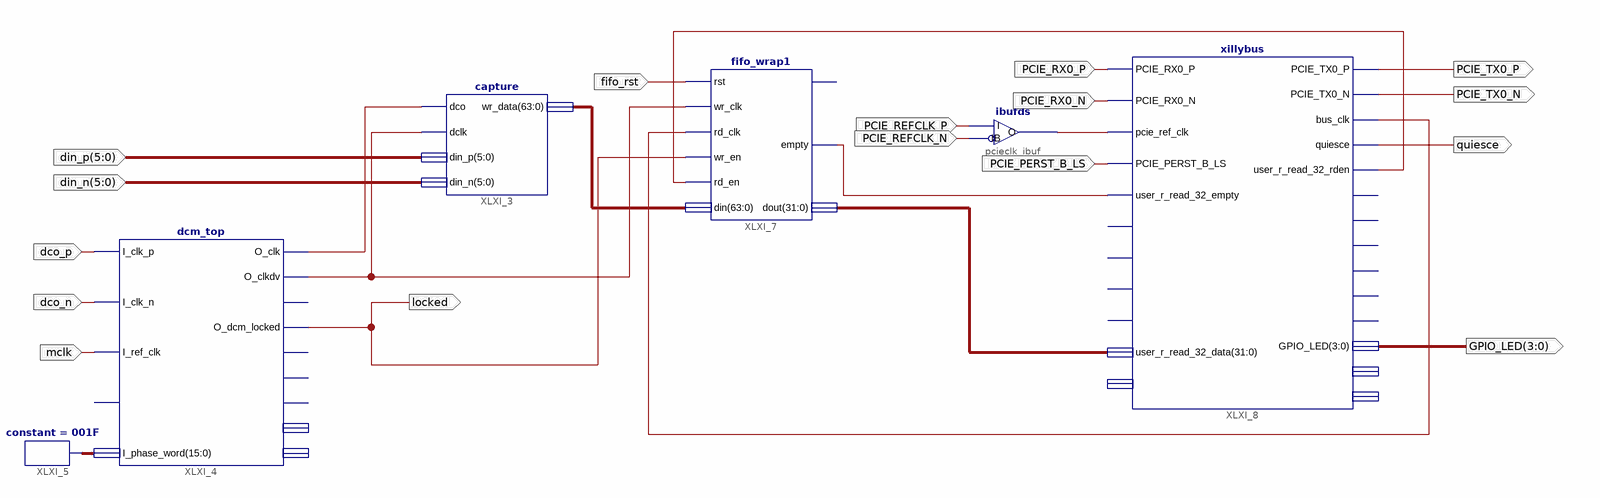
[diagram p0: schematic sheet 1]
// Xilinx ISE schematic top.sch (virtex5) as structural Verilog: 6 symbols, 16 ports
module top (
  input  dco_p,
  input  dco_n,
  input  mclk,
  input  [5:0] din_p,
  input  [5:0] din_n,
  input  fifo_rst,
  input  PCIE_RX0_P,
  input  PCIE_RX0_N,
  input  PCIE_REFCLK_P,
  input  PCIE_REFCLK_N,
  input  PCIE_PERST_B_LS,
  output locked,
  output PCIE_TX0_P,
  output PCIE_TX0_N,
  output quiesce,
  output [3:0] GPIO_LED
);

  wire pcie_ref_clk, XLXN_10, XLXN_11, XLXN_17, XLXN_18, XLXN_29;
  wire [15:0] XLXN_9;
  wire [31:0] XLXN_16;
  wire [63:0] XLXN_15;

  capture XLXI_3 (.dco(XLXN_10), .dclk(XLXN_11), .din_p(din_p), .din_n(din_n), .wr_data(XLXN_15));
  dcm_top XLXI_4 (
    .I_clk_p(dco_p), .I_clk_n(dco_n), .I_ref_clk(mclk), .I_phase_word(XLXN_9), .O_clk(XLXN_10),
    .O_clkdv(XLXN_11), .O_dcm_locked(locked));  // open: I_reset, O_dcm_reset, O_freq_mode, O_freq_or, O_dcm_psdone, O_freq_word, O_ctrl_state
  constant #(.CValue("001F")) XLXI_5 (.O(XLXN_9));
  fifo_wrap1 XLXI_7 (
    .rst(fifo_rst), .wr_clk(XLXN_11), .rd_clk(XLXN_29), .wr_en(locked), .rd_en(XLXN_17), .din(XLXN_15),
    .empty(XLXN_18), .dout(XLXN_16));  // open: full
  xillybus XLXI_8 (
    .PCIE_RX0_P(PCIE_RX0_P), .PCIE_RX0_N(PCIE_RX0_N), .pcie_ref_clk(pcie_ref_clk),
    .PCIE_PERST_B_LS(PCIE_PERST_B_LS), .user_r_read_32_empty(XLXN_18), .user_r_read_32_data(XLXN_16),
    .PCIE_TX0_P(PCIE_TX0_P), .PCIE_TX0_N(PCIE_TX0_N), .bus_clk(XLXN_29), .quiesce(quiesce),
    .user_r_read_32_rden(XLXN_17), .GPIO_LED(GPIO_LED));  // open: user_r_read_32_eof, user_r_mem_8_empty, user_r_mem_8_eof, user_w_mem_8_full, user_r_mem_8_data, user_r_read_32_open, user_r_mem_8_rden, user_r_mem_8_open, user_w_mem_8_wren, user_w_mem_8_open, user_mem_8_addr_update, user_w_mem_8_data, user_mem_8_addr
  ibufds pcieclk_ibuf (.I(PCIE_REFCLK_P), .IB(PCIE_REFCLK_N), .O(pcie_ref_clk));
endmodule
